# Altium project FMC_ADC.PrjPcb (part 2 of 4)

## Sheet ADC.SchDoc: ADC
size A3; Author: Wojciech Ruc³o; Organization: Warsaw Univeristy of Technology; Address1: Nowowiejska 15/19; DocumentNumber: 2; Revision: 1.0; SheetNumber: 2; SheetTotal: 12
Used 2 times, as channels U_ADC2, U_ADC1. Parts and nets are listed once, with the designators drawn on the sheet.
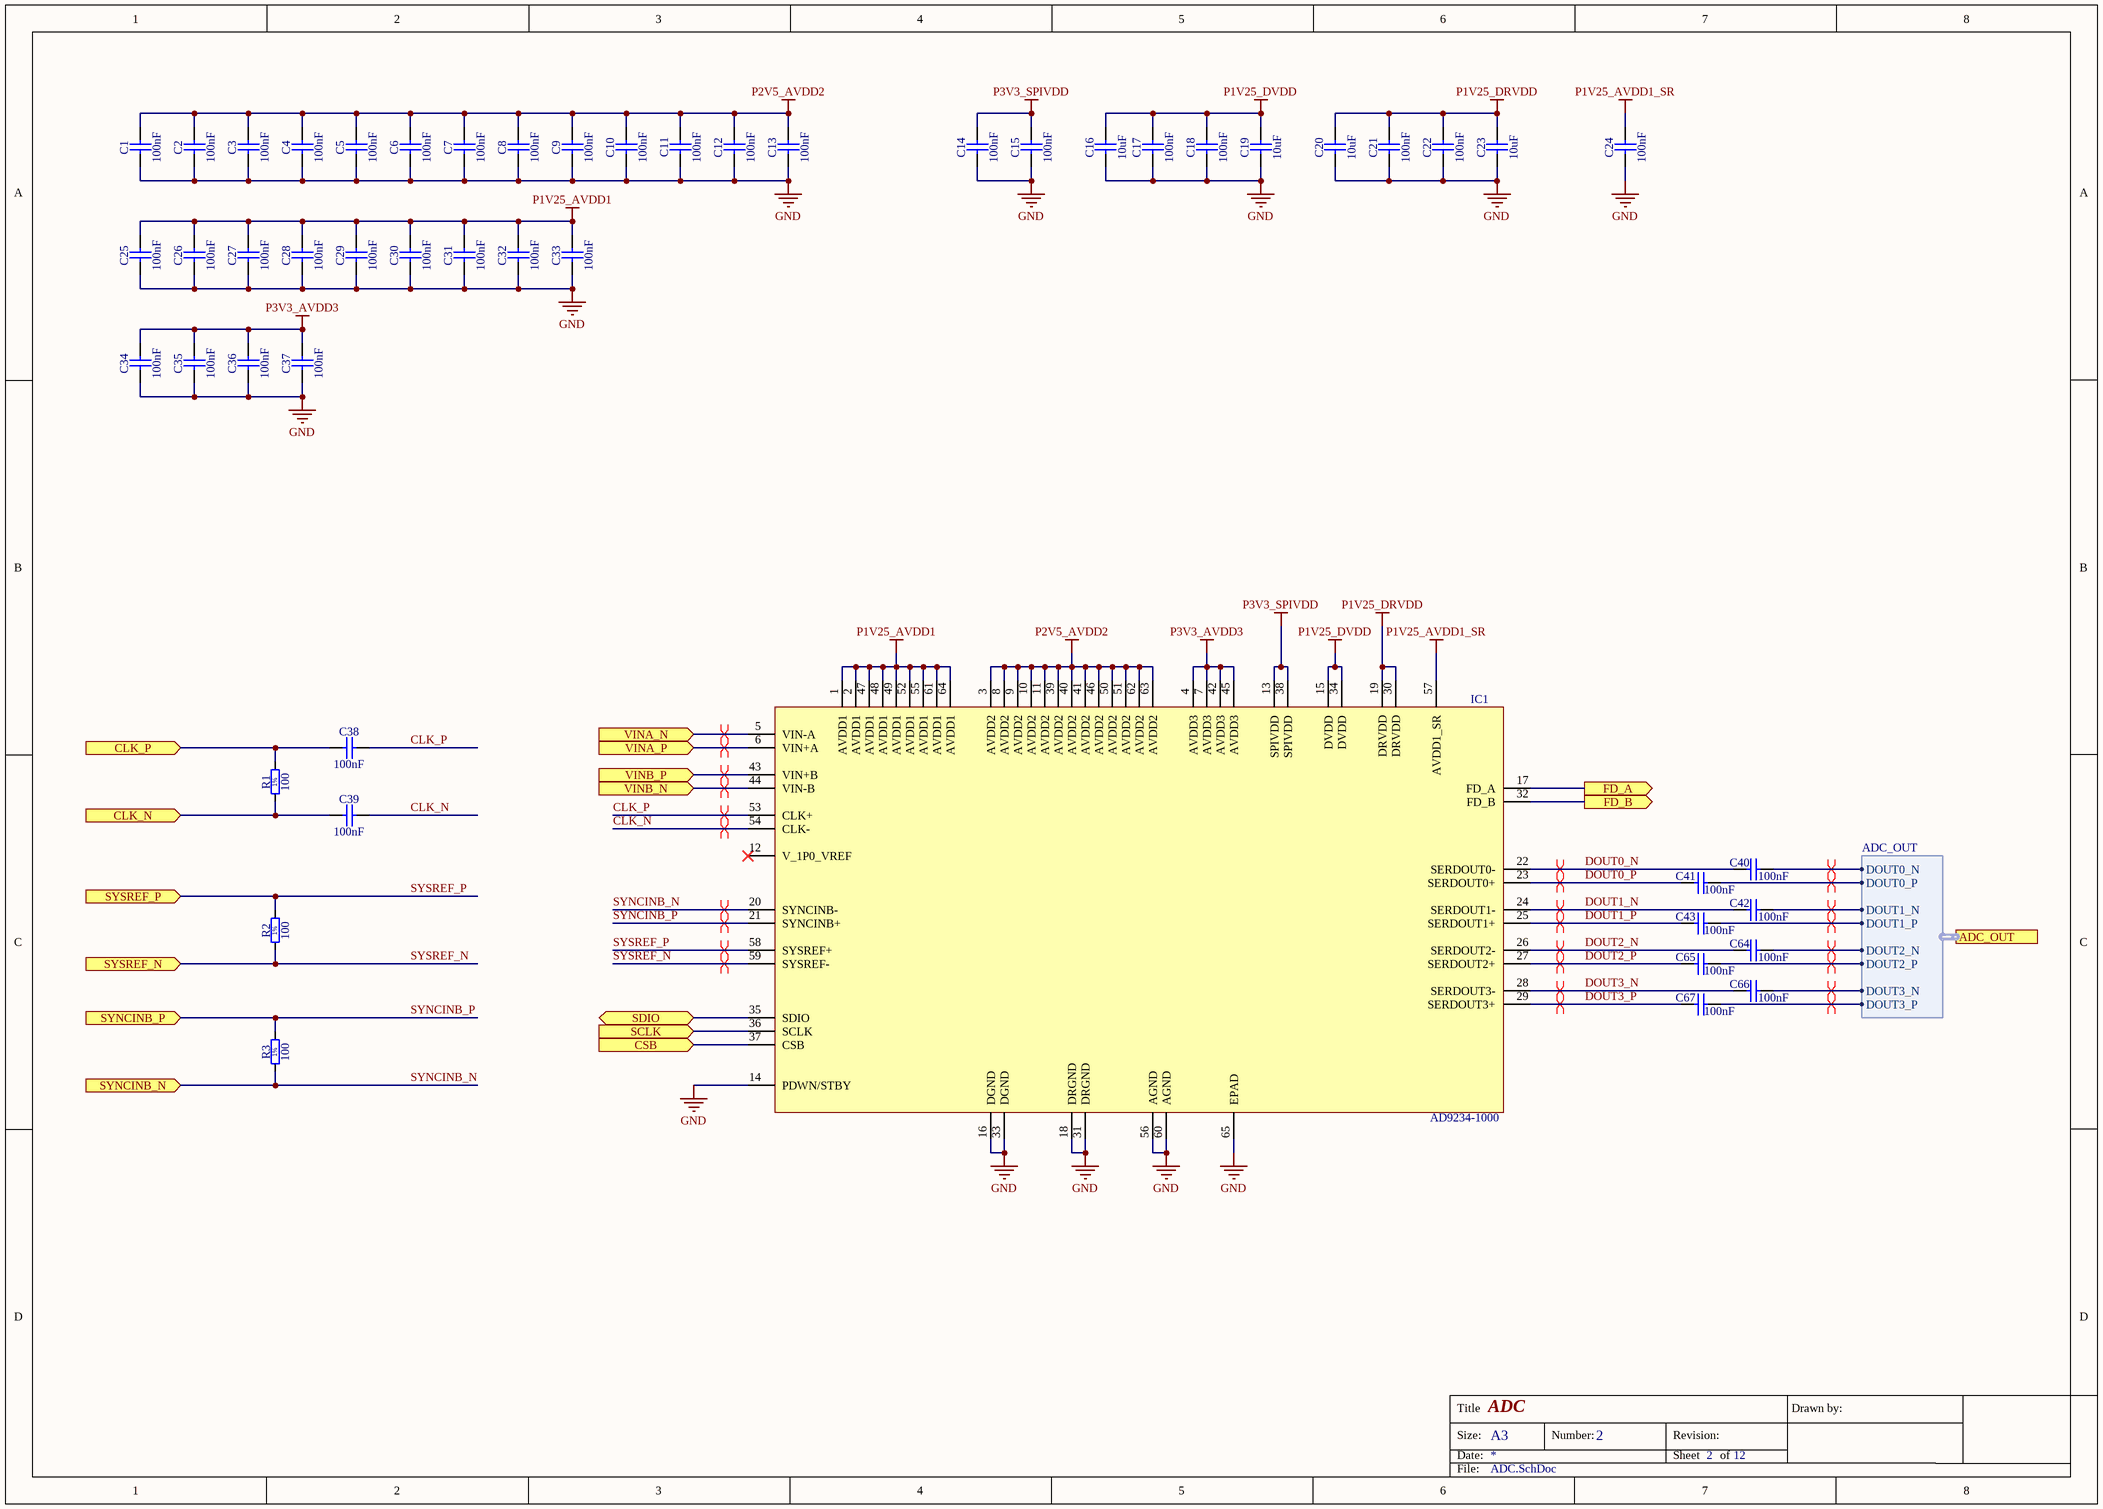
[diagram p3: ADC.SchDoc]

### Parts
C1  100nF  [CAPC0603X33N]
C2  100nF  [CAPC0603X33N]
C3  100nF  [CAPC0603X33N]
C4  100nF  [CAPC0603X33N]
C5  100nF  [CAPC0603X33N]
C6  100nF  [CAPC0603X33N]
C7  100nF  [CAPC0603X33N]
C8  100nF  [CAPC0603X33N]
C9  100nF  [CAPC0603X33N]
C10  100nF  [CAPC0603X33N]
C11  100nF  [CAPC0603X33N]
C12  100nF  [CAPC0603X33N]
C13  100nF  [CAPC0603X33N]
C14  100nF  [CAPC0603X33N]
C15  100nF  [CAPC0603X33N]
C16  10uF  [CAPC1608X87N]
C17  100nF  [CAPC0603X33N]
C18  100nF  [CAPC0603X33N]
C19  10uF  [CAPC1608X87N]
C20  10uF  [CAPC1608X87N]
C21  100nF  [CAPC0603X33N]
C22  100nF  [CAPC0603X33N]
C23  10uF  [CAPC1608X87N]
C24  100nF  [CAPC0603X33N]
C25  100nF  [CAPC0603X33N]
C26  100nF  [CAPC0603X33N]
C27  100nF  [CAPC0603X33N]
C28  100nF  [CAPC0603X33N]
C29  100nF  [CAPC0603X33N]
C30  100nF  [CAPC0603X33N]
C31  100nF  [CAPC0603X33N]
C32  100nF  [CAPC0603X33N]
C33  100nF  [CAPC0603X33N]
C34  100nF  [CAPC0603X33N]
C35  100nF  [CAPC0603X33N]
C36  100nF  [CAPC0603X33N]
C37  100nF  [CAPC0603X33N]
C38  100nF  [CAPC0603X33N]
C39  100nF  [CAPC0603X33N]
C40  100nF  [CAPC0603X33N]
C41  100nF  [CAPC0603X33N]
C42  100nF  [CAPC0603X33N]
C43  100nF  [CAPC0603X33N]
C64  100nF  [CAPC0603X33N]
C65  100nF  [CAPC0603X33N]
C66  100nF  [CAPC0603X33N]
C67  100nF  [CAPC0603X33N]
IC1  AD9234-1000  [CP_64_15]
R1  100  [RESC1005X40N]
R2  100  [RESC1005X40N]
R3  100  [RESC1005X40N]

### Ports
ADC_OUT (harness ADC_OUT), CLK_N (in), CLK_P (in), CSB (in), FD_A (out), FD_B (out), SCLK (in), SDIO (bidir), SYNCINB_N (in), SYNCINB_P (in), SYSREF_N (in), SYSREF_P (in), VINA_N (in), VINA_P (in), VINB_N (in), VINB_P (in)

### Harnesses
ADC_OUT: DOUT0_N, DOUT0_P, DOUT1_N, DOUT1_P, DOUT2_N, DOUT2_P, DOUT3_N, DOUT3_P

### Nets
GND: C1.1 C2.1 C3.1 C4.1 C5.1 C6.1 C7.1 C8.1 C9.1 C10.1 C11.1 C12.1 C13.1 C14.1 C15.1 C16.1 C17.1 C18.1 C19.1 C20.1 C21.1 C22.1 C23.1 C24.1 C25.1 C26.1 C27.1 C28.1 C29.1 C30.1 C31.1 C32.1 C33.1 C34.1 C35.1 C36.1 C37.1 IC1.14(PDWN/STBY) IC1.16(DGND) IC1.18(DRGND) IC1.31(DRGND) IC1.33(DGND) IC1.56(AGND) IC1.60(AGND) IC1.65(EPAD)
P1V25_AVDD1: C25.2 C26.2 C27.2 C28.2 C29.2 C30.2 C31.2 C32.2 C33.2 IC1.1(AVDD1) IC1.2(AVDD1) IC1.47(AVDD1) IC1.48(AVDD1) IC1.49(AVDD1) IC1.52(AVDD1) IC1.55(AVDD1) IC1.61(AVDD1) IC1.64(AVDD1)
P1V25_AVDD1_SR: C24.2 IC1.57(AVDD1_SR)
P1V25_DRVDD: C20.2 C21.2 C22.2 C23.2 IC1.19(DRVDD) IC1.30(DRVDD)
P1V25_DVDD: C16.2 C17.2 C18.2 C19.2 IC1.15(DVDD) IC1.34(DVDD)
P2V5_AVDD2: C1.2 C2.2 C3.2 C4.2 C5.2 C6.2 C7.2 C8.2 C9.2 C10.2 C11.2 C12.2 C13.2 IC1.3(AVDD2) IC1.8(AVDD2) IC1.9(AVDD2) IC1.10(AVDD2) IC1.11(AVDD2) IC1.39(AVDD2) IC1.40(AVDD2) IC1.41(AVDD2) IC1.46(AVDD2) IC1.50(AVDD2) IC1.51(AVDD2) IC1.62(AVDD2) IC1.63(AVDD2)
P3V3_AVDD3: C34.2 C35.2 C36.2 C37.2 IC1.4(AVDD3) IC1.7(AVDD3) IC1.42(AVDD3) IC1.45(AVDD3)
P3V3_SPIVDD: C14.2 C15.2 IC1.13(SPIVDD) IC1.38(SPIVDD)
CLK_N: C39.2 IC1.54(CLK-)
CLK_N: C39.1 R1.1 ; port CLK_N  [a separate net that carries the same name]
CLK_P: C38.2 IC1.53(CLK+)
CLK_P: C38.1 R1.2 ; port CLK_P  [a separate net that carries the same name]
CSB: IC1.37(CSB) ; port CSB
DOUT0_N: C40.1 IC1.22(SERDOUT0-)
DOUT0_P: C41.1 IC1.23(SERDOUT0+)
DOUT1_N: C42.1 IC1.24(SERDOUT1-)
DOUT1_P: C43.1 IC1.25(SERDOUT1+)
DOUT2_N: C64.1 IC1.26(SERDOUT2-)
DOUT2_P: C65.1 IC1.27(SERDOUT2+)
DOUT3_N: C66.1 IC1.28(SERDOUT3-)
DOUT3_P: C67.1 IC1.29(SERDOUT3+)
FD_A: IC1.17(FD_A) ; port FD_A
FD_B: IC1.32(FD_B) ; port FD_B
SCLK: IC1.36(SCLK) ; port SCLK
SDIO: IC1.35(SDIO) ; port SDIO
SYNCINB_N: IC1.20(SYNCINB-) R3.1 ; port SYNCINB_N
SYNCINB_P: IC1.21(SYNCINB+) R3.2 ; port SYNCINB_P
SYSREF_N: IC1.59(SYSREF-) R2.1 ; port SYSREF_N
SYSREF_P: IC1.58(SYSREF+) R2.2 ; port SYSREF_P
VINA_N: IC1.5(VIN-A) ; port VINA_N
VINA_P: IC1.6(VIN+A) ; port VINA_P
VINB_N: IC1.44(VIN-B) ; port VINB_N
VINB_P: IC1.43(VIN+B) ; port VINB_P
NetC40_2: C40.2 ; port ADC_OUT.DOUT0_N
NetC41_2: C41.2 ; port ADC_OUT.DOUT0_P
NetC42_2: C42.2 ; port ADC_OUT.DOUT1_N
NetC43_2: C43.2 ; port ADC_OUT.DOUT1_P
NetC64_2: C64.2 ; port ADC_OUT.DOUT2_N
NetC65_2: C65.2 ; port ADC_OUT.DOUT2_P
NetC66_2: C66.2 ; port ADC_OUT.DOUT3_N
NetC67_2: C67.2 ; port ADC_OUT.DOUT3_P

Not connected (* = marked no-connect by the designer): IC1 12(V_1P0_VREF)*

### Channels
U_ADC2: designators end in A; ports CLK_N=CLK_ADC2_N CLK_P=CLK_ADC2_P CSB=CS_ADC2 FD_A=FD_C FD_B=FD_D SCLK=SCLK_ADC SDIO=SDIO_ADC SYNCINB_N=LA03_N SYNCINB_P=LA03_P SYSREF_N=SYSREF2_N SYSREF_P=SYSREF2_P VINA_N=VINC_N VINA_P=VINC_P VINB_N=VIND_N VINB_P=VIND_P
U_ADC1: designators end in B; ports CLK_N=CLK_ADC1_N CLK_P=CLK_ADC1_P CSB=CS_ADC1 FD_A=FD_A FD_B=FD_B SCLK=SCLK_ADC SDIO=SDIO_ADC SYNCINB_N=LA30_N SYNCINB_P=LA30_P SYSREF_N=SYSREF1_N SYSREF_P=SYSREF1_P VINA_N=VINA_N VINA_P=VINA_P VINB_N=VINB_N VINB_P=VINB_P

### Layout directives
differential pair: CLK_N_U_ADC2, CLK_P_U_ADC2, DOUT0_N_U_ADC2, DOUT0_P_U_ADC2, DOUT1_N_U_ADC2, DOUT1_P_U_ADC2, DOUT2_N_U_ADC2, DOUT2_P_U_ADC2, DOUT3_N_U_ADC2, DOUT3_P_U_ADC2, DP0_M2C_N, DP0_M2C_P, DP1_M2C_N, DP1_M2C_P, DP2_M2C_N, DP2_M2C_P, DP3_M2C_N, DP3_M2C_P, LA03_N, LA03_P, SYSREF2_N, SYSREF2_P, VINC_N, VINC_P, VIND_N, VIND_P

### Notes on the sheet
- Title
- Size:
- Date:
- A3
- Number:
- Revision:
- Sheet
- of
- Drawn by:
- File:
- (in symbol R0402_100R_1%_0.0625W_100PPM) 1%

### Library data of the parts
C1-C15 C17 C18 C21 C22 C24-C43 C64-C67 = CC0201_100NF_6.3V_10%_X5R: as C78 on sheet FMC_CONNECTOR; Value: 100nF; Part Number: CC0201_100NF_6.3V_10%_X5R; Component Kind: Standard; Component Type: Standard; Pin Count: 2; Status: Not Recommended; Manufacturer Part Number: CC0201_100NF_6.3V_10%_X5R; Case: 0201; Mounted: Yes; Socket: No; SMD: Yes; Sense: No; Manufacturer1 Example: AVX; Manufacturer1 ComponentHeight: 0.33mm; HelpURL: \\cern.ch\dfs\Applications\Altium\Datasheets\CC0201_X5R_AVX.pdf; Author: CERN DEM JLC; CreateDate: 03.12.2007; LatestRevisionDate: 03.12.2007
C16 C19 C20 C23 = CC0603_10UF_6.3V_20%_X5R: Non-polarised capacitor; Part Description: SMD Multilayer Chip Ceramic Capacitor; Manufacturer: GENERIC; Manufacturer1 Part Number: C0603C106M9PAC; Voltage: 6.3V; TC: X5R; Tolerance: ±20%; Part Number: CC0603_10UF_6.3V_20%_X5R; Component Kind: Standard; Component Type: Standard; Pin Count: 2; Value: 10uF; Status: Preferred; Manufacturer Part Number: CC0603_10uF_6.3V_20%_X5R; Case: 0603; Mounted: Yes; Socket: No; SMD: Yes; Sense: No; Manufacturer1 Example: KEMET; Manufacturer1 ComponentHeight: 0.95mm; HelpURL: \\cern.ch\dfs\Applications\Altium\Datasheets\CC0603_X5R_KEMET.pdf; Author: CERN DEM JLC; CreateDate: 03.12.2007; LatestRevisionDate: 03.12.2007
IC1 = AD9234-1000: 12-Bit, 1 GSPS/500 MSPS JESD204B, Dual Analog-to-Digital Converter; Manufacturer: Analog Devices Inc; Manufacturer Part Number: AD9234BCPZ-1000
R1-R3 = R0402_100R_1%_0.0625W_100PPM: Resistor - 1%; Part Description: General Purpose Thick Film Chip Resistor; Manufacturer: GENERIC; Manufacturer1 Part Number: 232270671001L; TC: ±100ppm/°C; Part Number: R0402_100R_1%_0.0625W_100PPM; Component Kind: Standard; Component Type: Standard; Pin Count: 2; Value: 100; Status: Not recommended; Power: 0.0625W; Tolerance: ±1%; Manufacturer Part Number: R0402_100R_1%_0.0625W_100PPM; Case: 0402; Mounted: Yes; Socket: No; SMD: Yes; Manufacturer1 Example: YAGEO PHYCOMP; Manufacturer1 ComponentHeight: 0.4mm; HelpURL: \\cern.ch\dfs\Applications\Altium\Datasheets\R0402_Phycomp_RC0402.pdf; Author: CERN DEM JLC; CreateDate: 03.12.2007; LatestRevisionDate: 17.10.2012; Sense: No

## Sheet CLOCK.SchDoc: Clocks
size A3; Author: Wojciech Ruc³o; Organization: Warsaw Univeristy of Technology; Address1: Nowowiejska 15/19; DocumentNumber: 5; Revision: 1.0; SheetNumber: 5; SheetTotal: 12
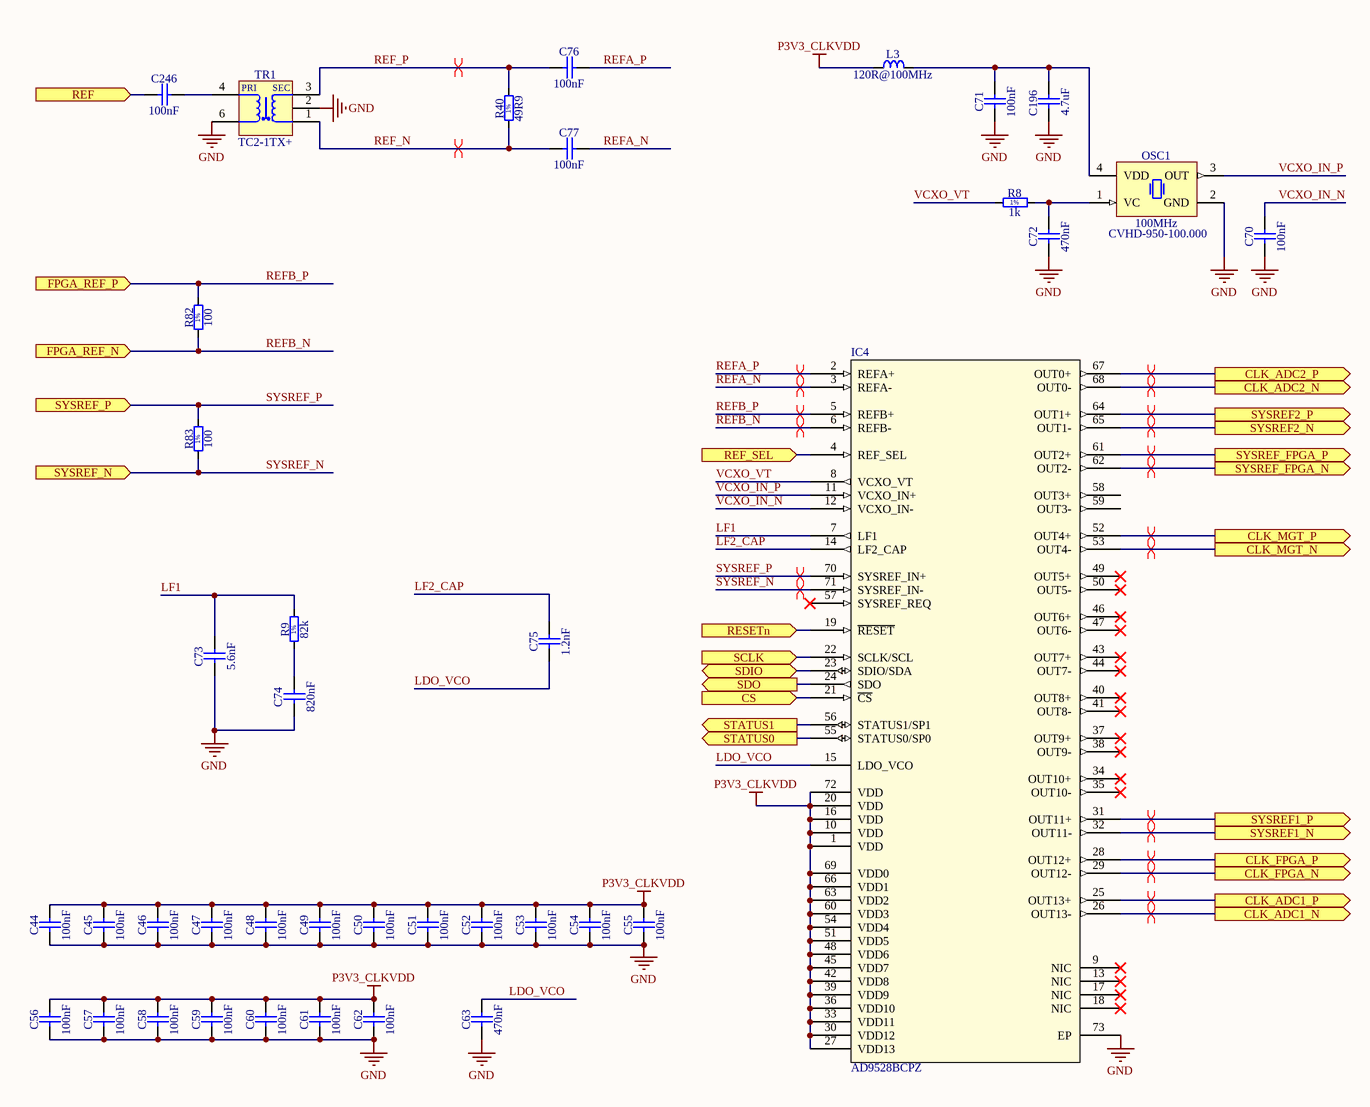
[diagram p4: CLOCK.SchDoc]

### Parts
C44  100nF  [CAPC0603X33N]
C45  100nF  [CAPC0603X33N]
C46  100nF  [CAPC0603X33N]
C47  100nF  [CAPC0603X33N]
C48  100nF  [CAPC0603X33N]
C49  100nF  [CAPC0603X33N]
C50  100nF  [CAPC0603X33N]
C51  100nF  [CAPC0603X33N]
C52  100nF  [CAPC0603X33N]
C53  100nF  [CAPC0603X33N]
C54  100nF  [CAPC0603X33N]
C55  100nF  [CAPC0603X33N]
C56  100nF  [CAPC0603X33N]
C57  100nF  [CAPC0603X33N]
C58  100nF  [CAPC0603X33N]
C59  100nF  [CAPC0603X33N]
C60  100nF  [CAPC0603X33N]
C61  100nF  [CAPC0603X33N]
C62  100nF  [CAPC0603X33N]
C63  470nF  [CAPC1005X55N]
C70  100nF  [CAPC0603X33N]
C71  100nF  [CAPC0603X33N]
C72  470nF  [CAPC1005X55N]
C73  5.6nF  [CAPC2012X88N]
C74  820nF  [CAPC3216X130N]
C75  1.2nF  [CAPC1608X80N]
C76  100nF  [CAPC1005X55N]
C77  100nF  [CAPC1005X55N]
C196  4.7uF  [CAPC1608X87N]
C246  100nF  [CAPC0603X33N]
IC4  AD9528BCPZ  [CP_72_6]
L3  120R@100MHz  [INDC1608X65N]
OSC1  100MHz  Manufacturer Part Number: CVHD-950-100.000  [OSC_CRYSTEK_CVHD-950]
R8  1k  [RESC1005X40N]
R9  82k  [RESC1005X40N]
R40  49R9  [RESC1005X40N]
R82  100  [RESC1005X40N]
R83  100  [RESC1005X40N]
TR1  TC2-1TX+  [XFMR_MINI-CIRCUITS_AT1521]

### Ports
CLK_ADC1_N (out), CLK_ADC1_P (out), CLK_ADC2_N (out), CLK_ADC2_P (out), CLK_FPGA_N (out), CLK_FPGA_P (out), CLK_MGT_N (out), CLK_MGT_P (out), CS (in), FPGA_REF_N (in), FPGA_REF_P (in), REF (in), REF_SEL (in), RESETn (in), SCLK (in), SDIO (bidir), SDO (out), STATUS0 (out), STATUS1 (out), SYSREF1_N (out), SYSREF1_P (out), SYSREF2_N (out), SYSREF2_P (out), SYSREF_FPGA_N (out), SYSREF_FPGA_P (out), SYSREF_N (in), SYSREF_P (in)

### Nets
GND: C44.1 C45.1 C46.1 C47.1 C48.1 C49.1 C50.1 C51.1 C52.1 C53.1 C54.1 C55.1 C56.1 C57.1 C58.1 C59.1 C60.1 C61.1 C62.1 C63.1 C70.1 C71.1 C72.1 C73.1 C74.1 C196.1 IC4.73(EP) OSC1.2(GND) TR1.2(NU) TR1.6(PDOT)
P3V3_CLKVDD: C44.2 C45.2 C46.2 C47.2 C48.2 C49.2 C50.2 C51.2 C52.2 C53.2 C54.2 C55.2 C56.2 C57.2 C58.2 C59.2 C60.2 C61.2 C62.2 IC4.1(VDD) IC4.10(VDD) IC4.16(VDD) IC4.20(VDD) IC4.27(VDD13) IC4.30(VDD12) IC4.33(VDD11) IC4.36(VDD10) IC4.39(VDD9) IC4.42(VDD8) IC4.45(VDD7) IC4.48(VDD6) IC4.51(VDD5) IC4.54(VDD4) IC4.60(VDD3) IC4.63(VDD2) IC4.66(VDD1) IC4.69(VDD0) IC4.72(VDD) L3.1
CLK_ADC1_N: IC4.26(OUT13-) ; port CLK_ADC1_N
CLK_ADC1_P: IC4.25(OUT13+) ; port CLK_ADC1_P
CLK_ADC2_N: IC4.68(OUT0-) ; port CLK_ADC2_N
CLK_ADC2_P: IC4.67(OUT0+) ; port CLK_ADC2_P
CLK_FPGA_N: IC4.29(OUT12-) ; port CLK_FPGA_N
CLK_FPGA_P: IC4.28(OUT12+) ; port CLK_FPGA_P
CLK_MGT_N: IC4.53(OUT4-) ; port CLK_MGT_N
CLK_MGT_P: IC4.52(OUT4+) ; port CLK_MGT_P
CS_CLK: IC4.21(~{CS}) ; port CS
LA01_CC_N: IC4.62(OUT2-) ; port SYSREF_FPGA_N
LA01_CC_P: IC4.61(OUT2+) ; port SYSREF_FPGA_P
LDO_VCO: C63.2 C75.1 IC4.15(LDO_VCO)
LF1: C73.2 IC4.7(LF1) R9.2
LF2_CAP: C75.2 IC4.14(LF2_CAP)
REF_N: C77.1 R40.1 TR1.1(SDOT)
REF_P: C76.1 R40.2 TR1.3(S)
REF_SEL: IC4.4(REF_SEL) ; port REF_SEL
REFA_N: C77.2 IC4.3(REFA-)
REFA_P: C76.2 IC4.2(REFA+)
REFB_N: IC4.6(REFB-) R82.1 ; port FPGA_REF_N  [project net FPGA_REF_N]
REFB_P: IC4.5(REFB+) R82.2 ; port FPGA_REF_P  [project net FPGA_REF_P]
RESETn: IC4.19(~{RESET}) ; port RESETn
SCLK_CLK: IC4.22(SCLK/SCL) ; port SCLK
SDIO_CLK: IC4.23(SDIO/SDA) ; port SDIO
SDO_CLK: IC4.24(SDO) ; port SDO
STATUS0: IC4.55(STATUS0/SP0) ; port STATUS0
STATUS1: IC4.56(STATUS1/SP1) ; port STATUS1
SYSREF1_N: IC4.32(OUT11-) ; port SYSREF1_N
SYSREF1_P: IC4.31(OUT11+) ; port SYSREF1_P
SYSREF2_N: IC4.65(OUT1-) ; port SYSREF2_N
SYSREF2_P: IC4.64(OUT1+) ; port SYSREF2_P
SYSREF_N: IC4.71(SYSREF_IN-) R83.1 ; port SYSREF_N  [project net LA00_CC_N]
SYSREF_P: IC4.70(SYSREF_IN+) R83.2 ; port SYSREF_P  [project net LA00_CC_P]
VCXO_IN_N: C70.2 IC4.12(VCXO_IN-)
VCXO_IN_P: IC4.11(VCXO_IN+) OSC1.3(OUT)
VCXO_VT: IC4.8(VCXO_VT) R8.1
NetC71_2: C71.2 C196.2 L3.2 OSC1.4(VDD)
NetC72_2: C72.2 OSC1.1(VC) R8.2
NetC74_2: C74.2 R9.1
NetC246_1: C246.1 ; port REF
NetC246_2: C246.2 TR1.4(P)

Not connected (* = marked no-connect by the designer): IC4 9(NIC)* 13(NIC)* 17(NIC)* 18(NIC)* 34(OUT10+)* 35(OUT10-)* 37(OUT9+)* 38(OUT9-)* 40(OUT8+)* 41(OUT8-)* 43(OUT7+)* 44(OUT7-)* 46(OUT6+)* 47(OUT6-)* 49(OUT5+)* 50(OUT5-)* 57(SYSREF_REQ)* 58(OUT3+) 59(OUT3-)

### Layout directives
differential pair: CLK_ADC1_N, CLK_ADC1_P, CLK_ADC2_N, CLK_ADC2_P, CLK_FPGA_N, CLK_FPGA_P, CLK_MGT_N, CLK_MGT_P, FPGA_REF_N, FPGA_REF_P, LA00_CC_N, LA00_CC_P, LA01_CC_N, LA01_CC_P, REF_N, REF_P, REFA_N, REFA_P, SYSREF1_N, SYSREF1_P, SYSREF2_N, SYSREF2_P

### Notes on the sheet
- Title
- Size:
- Date:
- A3
- Number:
- Revision:
- Sheet
- of
- Drawn by:
- File:
- (in symbol R0402_1K_1%_0.0625W_100PPM) 1%
- (in symbol R0402_49R9_1%_0.0625W_100PPM) 1%
- (in symbol R0402_82K_1%_0.0625W_100PPM) 1%
- (in symbol R0402_100R_1%_0.0625W_100PPM) 1%
- (in symbol XFMR_MINI-CIRCUITS_TC2-1TX+) PRI; SEC

### Library data of the parts
C44-C62 C70 C71 = CC0201_100NF_6.3V_10%_X5R: Non-polarised capacitor; Part Description: SMD Multilayer Chip Ceramic Capacitor; Manufacturer: GENERIC; Manufacturer1 Part Number: 02016D104KAT2A; Tolerance: ±10%; Voltage: 6.3V; TC: X5R; Value: 100nF; Part Number: CC0201_100NF_6.3V_10%_X5R; Component Kind: Standard; Component Type: Standard; Pin Count: 2; Status: Not Recommended; Manufacturer Part Number: CC0201_100NF_6.3V_10%_X5R; Case: 0201; Mounted: Yes; Socket: No; SMD: Yes; Sense: No; Manufacturer1 Example: AVX; Manufacturer1 ComponentHeight: 0.33mm; HelpURL: \\cern.ch\dfs\Applications\Altium\Datasheets\CC0201_X5R_AVX.pdf; Author: CERN DEM JLC; CreateDate: 03.12.2007; LatestRevisionDate: 03.12.2007
C63 C72 = CC0402_470NF_6.3V_10%_X5R: Non-polarised capacitor; Part Description: SMD Multilayer Chip Ceramic Capacitor; Manufacturer: GENERIC; Manufacturer1 Part Number: GRM155R60J474KE19D; Tolerance: ±10%; Voltage: 6.3V; TC: X5R; Value: 470nF; Part Number: CC0402_470NF_6.3V_10%_X5R; Component Kind: Standard; Component Type: Standard; Pin Count: 2; Status: Preferred; Manufacturer Part Number: CC0402_470NF_6.3V_10%_X5R; Case: 0402; Mounted: Yes; Socket: No; SMD: Yes; Sense: No; Manufacturer1 Example: MURATA; Manufacturer1 ComponentHeight: 0.55mm; HelpURL: \\cern.ch\dfs\Applications\Altium\Datasheets\CC0402_X5R_MURATA_GRM.pdf; Author: CERN DEM JLC; CreateDate: 22.04.2010; LatestRevisionDate: 22.04.2010
C73 = CC0805_5.6NF_50V_5%_C0G: Non-polarised capacitor; Part Description: SMD Multilayer Chip Ceramic Capacitor; Manufacturer: GENERIC; Manufacturer1 Part Number: GRM2195C1H562JA01D; Voltage: 50V; TC: C0G/NP0; Tolerance: ±5%; Part Number: CC0805_5.6NF_50V_5%_C0G; Component Kind: Standard; Component Type: Standard; Pin Count: 2; Value: 5.6nF; Status: Preferred; Manufacturer Part Number: CC0805_5.6NF_50V_5%_C0G; Case: 0805; Mounted: Yes; Socket: No; SMD: Yes; Sense: No; Manufacturer1 Example: Murata; Manufacturer1 ComponentHeight: 0.85mm; Author: *
C74 = CC1206_820NF_25V_10%_X7R: Non-polarised capacitor; Part Description: SMD Multilayer Chip Ceramic Capacitor; Manufacturer: GENERIC; Manufacturer1 Part Number: 12063C824KAT2A; Voltage: 25V; TC: X7R; Tolerance: ±10%; Part Number: CC1206_820NF_25V_10%_X7R; Component Kind: Standard; Component Type: Standard; Pin Count: 2; Value: 820nF; Manufacturer Part Number: CC1206_820NF_25V_10%_X7R; Case: 1206; Mounted: Yes; Socket: No; SMD: Yes; Sense: No; Manufacturer1 ComponentHeight: 1.25mm; Manufacturer1 Example: AVX
C75 = CC0603_1.2NF_50V_5%_C0G: Non-polarised capacitor; Part Description: SMD Multilayer Chip Ceramic Capacitor; Manufacturer: GENERIC; Manufacturer1 Part Number: C0603C122J5GACTU; Tolerance: ±5%; Voltage: 50V; TC: C0G/NP0; Value: 1.2nF; Part Number: CC0603_1.2NF_50V_5%_C0G; Component Kind: Standard; Component Type: Standard; Pin Count: 2; Status: Preferred; Manufacturer Part Number: CC0603_1.2NF_50V_5%_C0G; Case: 0603; Mounted: Yes; Socket: No; SMD: Yes; Sense: No; Manufacturer1 Example: KEMET; Manufacturer1 ComponentHeight: 0.8mm; Author: *
C76 C77 = CC0402_100NF_16V_10%_X5R: Non-polarised capacitor; Part Description: SMD Multilayer Chip Ceramic Capacitor; Manufacturer: GENERIC; Manufacturer1 Part Number: GRM155R61C104KA88D; Tolerance: ±10%; Voltage: 16V; TC: X5R; Value: 100nF; Part Number: CC0402_100NF_16V_10%_X5R; Component Kind: Standard; Component Type: Standard; Pin Count: 2; Status: None; Manufacturer Part Number: CC0402_100NF_16V_10%_X5R; Case: 0402; Mounted: Yes; Socket: No; SMD: Yes; Sense: No; Manufacturer1 Example: MURATA; Manufacturer1 ComponentHeight: 0.55mm; HelpURL: \\cern.ch\dfs\Applications\Altium\Datasheets\CC0402_X5R_MURATA_GRM.pdf; Author: CERN DEM JLC; CreateDate: 10.12.2013; LatestRevisionDate: 10.12.2013
C196 = CC0603_4.7UF_6.3V_10%_X5R: Non-polarised capacitor; Part Description: SMD Multilayer Chip Ceramic Capacitor; Manufacturer: GENERIC; Manufacturer1 Part Number: 225520613672; Voltage: 6.3V; TC: X5R; Tolerance: ±10%; Part Number: CC0603_4.7UF_6.3V_10%_X5R; Component Kind: Standard; Component Type: Standard; Pin Count: 2; Value: 4.7uF; Status: Preferred; Manufacturer Part Number: CC0603_4.7uF_6.3V_10%_X5R; Case: 0603; Mounted: Yes; Socket: No; SMD: Yes; Manufacturer1 Example: PHYCOMP; Manufacturer1 ComponentHeight: 0.87mm; HelpURL: \\cern.ch\dfs\Applications\Altium\Datasheets\CC0805_X5R_PHYCOMP_HC.pdf; Author: CERN DEM JLC; CreateDate: 03.12.2007; LatestRevisionDate: 03.12.2007; Sense: No
C246 = CC0201_100NF_6.3V_10%_X5R: Non-polarised capacitor; Part Description: SMD Multilayer Chip Ceramic Capacitor; Manufacturer: GENERIC; Manufacturer1 Part Number: 02016D104KAT2A; Voltage: 6.3V; TC: X5R; Tolerance: ±10%; Part Number: CC0201_100NF_6.3V_10%_X5R; Component Kind: Standard; Component Type: Standard; Pin Count: 2; Value: 100nF; Status: Not Recommended; Manufacturer Part Number: CC0201_100NF_6.3V_10%_X5R; Case: 0201; Mounted: Yes; Socket: No; SMD: Yes; Sense: No; Manufacturer1 Example: AVX; Manufacturer1 ComponentHeight: 0.33mm; HelpURL: \\cern.ch\dfs\Applications\Altium\Datasheets\CC0201_X5R_AVX.pdf; Author: CERN DEM JLC; CreateDate: 03.12.2007; LatestRevisionDate: 03.12.2007
IC4 = AD9528BCPZ: JESD204B Clock Generator with 14 LVDS/HSTL Outputs; Manufacturer: Analog Devices; Manufacturer Part Number: AD9528BCPZ
L3 = IND0603_MURATA_BLM18SG121TN1D: Inductor; Part Description: SMD EMIFIL Suppression Chip Ferrite Bead; Manufacturer: MURATA; Power: 3A; Resistance: 0.025R; Tolerance: ±25%; Part Number: IND0603_MURATA_BLM18SG121TN1D; Component Kind: Standard; Component Type: Standard; Pin Count: 2; Value: 120R@100MHz; Status: None; Manufacturer Part Number: BLM18SG121TN1D; Case: 0603; Mounted: Yes; Socket: No; SMD: Yes; Sense: No; ComponentHeight: 0.65mm; HelpURL: \\cern.ch\dfs\Applications\Altium\Datasheets\IND0603_MURATA_BLM18S.pdf; Author: CERN DEM JLC; CreateDate: 23.07.2014; LatestRevisionDate: 23.07.2014
OSC1 = OSC_125MHZ_CRYSTEK_CVHD-950-100.000: Oscillator 4 pins 1=VC 2=GND 3=OUT 4=VDD; Part Description: 3.3V, ±20ppm, 15pF, 0..70°C, CMOS Surface Mount Ultra-Low Noise Oscillator (CVHD-950 Series); Manufacturer: CRYSTEK CRYSTAL; PressFit: No; Bonding: No; Part Number: OSC_125MHZ_CRYSTEK_CVHD-950-100.000; Component Kind: Standard; Component Type: Standard; PackageDescription: Oscillator, 5.08mm Pitch; 4 Pin, 14.2mm L X 9.14mm W X 5.3mm H, CVHD-950 Serie; Value: 100MHz; Pin Count: 4; Mounted: Yes; Socket: No; SMD: Yes; ComponentHeight: 5.3mm; HelpURL: \\cern.ch\dfs\Applications\Altium\Datasheets\OSC_CRYSTEK_CVHD-950.pdf; Author: CERN DEM JLC; CreateDate: 09.10.2012; LatestRevisionDate: 09.10.2012; Sense: No
R8 = R0402_1K_1%_0.0625W_100PPM: Resistor - 1%; Part Description: General Purpose Thick Film Chip Resistor; Manufacturer: GENERIC; Manufacturer1 Part Number: 232270671002L; TC: ±100ppm/°C; Tolerance: ±1%; Value: 1k; Power: 0.0625W; Part Number: R0402_1K_1%_0.0625W_100PPM; Component Kind: Standard; Component Type: Standard; Pin Count: 2; Status: Not recommended; Manufacturer Part Number: R0402_1K_1%_0.0625W_100PPM; Case: 0402; Mounted: Yes; Sense: No; Socket: No; SMD: Yes; Manufacturer1 Example: YAGEO PHYCOMP; Manufacturer1 ComponentHeight: 0.4mm; HelpURL: \\cern.ch\dfs\Applications\Altium\Datasheets\R0402_Phycomp_RC0402.pdf; Author: CERN DEM JLC; CreateDate: 03.12.2007; LatestRevisionDate: 17.10.2012
R9 = R0402_82K_1%_0.0625W_100PPM: Resistor - 1%; Part Description: General Purpose Thick Film Chip Resistor; Manufacturer: GENERIC; Manufacturer1 Part Number: 232270678203L; TC: ±100ppm/°C; Value: 82k; Tolerance: ±1%; Power: 0.0625W; Part Number: R0402_82K_1%_0.0625W_100PPM; Component Kind: Standard; Component Type: Standard; Pin Count: 2; Status: Not recommended; Manufacturer Part Number: R0402_82K_1%_0.0625W_100PPM; Case: 0402; Mounted: Yes; Sense: No; Socket: No; SMD: Yes; Manufacturer1 Example: YAGEO PHYCOMP; Manufacturer1 ComponentHeight: 0.4mm; HelpURL: \\cern.ch\dfs\Applications\Altium\Datasheets\R0402_Phycomp_RC0402.pdf; Author: CERN DEM JLC; CreateDate: 03.12.2007; LatestRevisionDate: 17.10.2012
R40 = R0402_49R9_1%_0.0625W_100PPM: Resistor - 1%; Part Description: General Purpose Thick Film Chip Resistor; Manufacturer: GENERIC; Manufacturer1 Part Number: 232270674999L or RC0402FR-0749R9L; TC: ±100ppm/°C; Part Number: R0402_49R9_1%_0.0625W_100PPM; Component Kind: Standard; Component Type: Standard; Pin Count: 2; Value: 49R9; Status: Not recommended; Power: 0.0625W; Tolerance: ±1%; Manufacturer Part Number: R0402_49R9_1%_0.0625W_100PPM; Case: 0402; Mounted: Yes; Sense: No; Socket: No; SMD: Yes; Manufacturer1 Example: YAGEO PHYCOMP; Manufacturer1 ComponentHeight: 0.4mm; HelpURL: \\cern.ch\dfs\Applications\Altium\Datasheets\R0402_Phycomp_RC0402.pdf; Author: CERN DEM JLC; CreateDate: 24.10.2012; LatestRevisionDate: 24.10.2012
R82 R83 = R0402_100R_1%_0.0625W_100PPM: Resistor - 1%; Part Description: General Purpose Thick Film Chip Resistor; Manufacturer: GENERIC; Manufacturer1 Part Number: 232270671001L; TC: ±100ppm/°C; Part Number: R0402_100R_1%_0.0625W_100PPM; Component Kind: Standard; Component Type: Standard; Pin Count: 2; Value: 100; Status: Not recommended; Power: 0.0625W; Tolerance: ±1%; Manufacturer Part Number: R0402_100R_1%_0.0625W_100PPM; Case: 0402; Mounted: Yes; Socket: No; SMD: Yes; Manufacturer1 Example: YAGEO PHYCOMP; Manufacturer1 ComponentHeight: 0.4mm; HelpURL: \\cern.ch\dfs\Applications\Altium\Datasheets\R0402_Phycomp_RC0402.pdf; Author: CERN DEM JLC; CreateDate: 03.12.2007; LatestRevisionDate: 17.10.2012; Sense: No
TR1 = XFMR_MINI-CIRCUITS_TC2-1TX+: 50 Ohm 3 to 300MHz RF Transformer; Manufacturer: MINI-CIRCUITS; Manufacturer Part Number: TC2-1TX+; HelpURL: https://ww2.minicircuits.com/pdfs/TC2-1TX+.pdf

## Sheet POWER_SUPPLY_1.SchDoc: Power Supply
size A3; Author: Wojciech Ruc³o; Organization: Warsaw Univeristy of Technology; Address1: Nowowiejska 15/19; DocumentNumber: 8; Revision: 1.0; SheetNumber: 8; SheetTotal: 12
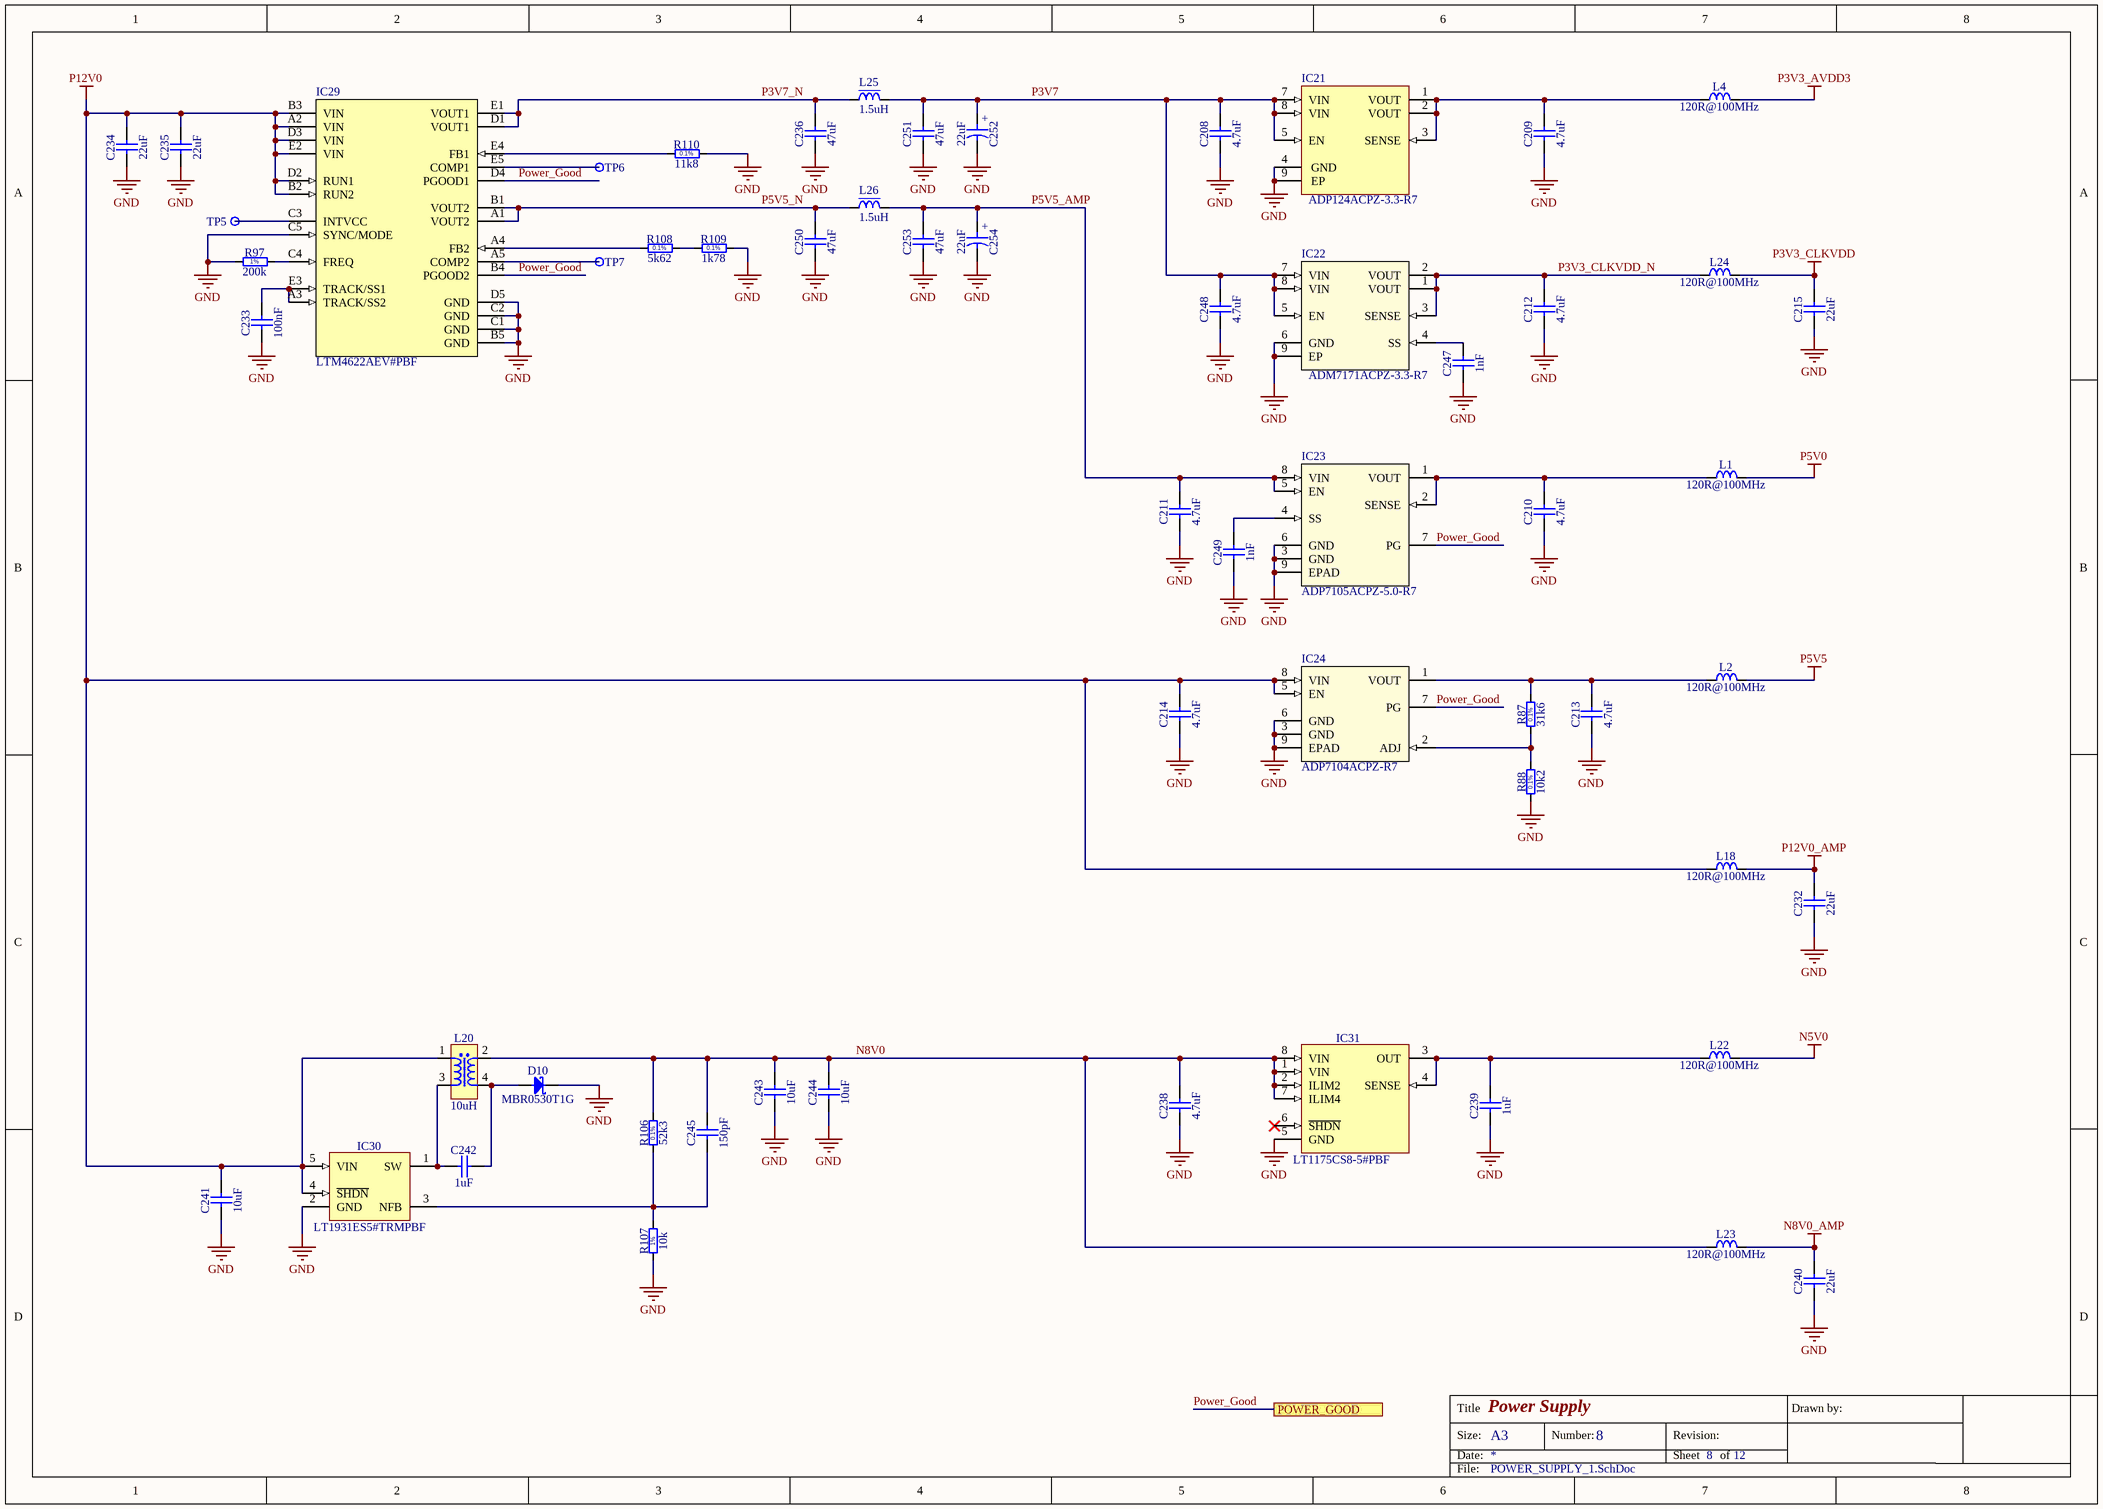
[diagram p5: POWER_SUPPLY_1.SchDoc]

### Parts
C208  4.7uF  [CAPC1709X95N]
C209  4.7uF  [CAPC1709X95N]
C210  4.7uF  [CAPC1709X95N]
C211  4.7uF  [CAPC1709X95N]
C212  4.7uF  [CAPC1709X95N]
C213  4.7uF  [CAPC1709X95N]
C214  4.7uF  [CAPC1709X95N]
C215  22uF  [CAPC1709X100N]
C232  22uF  [CAPC1709X100N]
C233  100nF  [CAPC1005X55N]
C234  22uF  [CAPC2012X135N]
C235  22uF  [CAPC2012X135N]
C236  47uF  [CAPC3225X270N]
C238  4.7uF  [CAPC1709X95N]
C239  1uF  [CAPC1608X87N]
C240  22uF  [CAPC1709X100N]
C241  10uF  [CAPC2012X135N]
C242  1uF  [CAPC1608X87N]
C243  10uF  [CAPC2012X135N]
C244  10uF  [CAPC2012X135N]
C245  150pF  [CAPC1005X55N]
C247  1nF  [CAPC0603X33N]
C248  4.7uF  [CAPC1709X95N]
C249  1nF  [CAPC0603X33N]
C250  47uF  [CAPC3225X270N]
C251  47uF  [CAPC3225X270N]
C252  22uF  [CAPMP3528X210N]
C253  47uF  [CAPC3225X270N]
C254  22uF  [CAPMP3528X210N]
D10  MBR0530T1G  [SOD3715X145N]
IC21  ADP124ACPZ-3.3-R7  [CP_8_8-L]
IC22  ADM7171ACPZ-3.3-R7  [CP_8_21-L]
IC23  ADP7105ACPZ-5.0-R7  [CP_8_5]
IC24  ADP7104ACPZ-R7  [CP_8_5]
IC29  LTM4622AEV#PBF  [LGA25C127P5X5_625X625X182]
IC30  LT1931ES5#TRMPBF  [SOT95P280X100-5N]
IC31  LT1175CS8-5#PBF  [SOIC127P600X175-8N]
L1  120R@100MHz  [INDC1608X65N]
L2  120R@100MHz  [INDC1608X65N]
L4  120R@100MHz  [INDC1608X65N]
L18  120R@100MHz  [INDC1608X65N]
L20  10uH  [IND_BOURNS_SRF0703]
L22  120R@100MHz  [INDC1608X65N]
L23  120R@100MHz  [INDC1608X65N]
L24  120R@100MHz  [INDC1608X65N]
L25  1.5uH  [IND_SPM4020]
L26  1.5uH  [IND_SPM4020]
R87  31k6  [RESC1608X55N]
R88  10k2  [RESC1608X55N]
R97  200k  [RESC1005X40N]
R106  52k3  [RESC1608X55N]
R107  10k  [RESC1608X55N]
R108  5k62  [RESC1608X55N]
R109  1k78  [RESC1608X55N]
R110  11k8  [RESC1608X55N]
TP5  Test Point  [TPS62]  (value not drawn)
TP6  Test Point  [TPS62]  (value not drawn)
TP7  Test Point  [TPS62]  (value not drawn)

### Ports
POWER_GOOD

### Nets
GND: C208.1 C209.1 C210.1 C211.1 C212.1 C213.1 C214.1 C215.1 C232.1 C233.1 C234.1 C235.1 C236.1 C238.1 C239.1 C240.1 C241.1 C243.1 C244.1 C247.1 C248.1 C249.1 C250.1 C251.1 C252.2 C253.1 C254.2 D10.1(C) IC21.4(GND) IC21.9(EP) IC22.6(GND) IC22.9(EP) IC23.3(GND) IC23.6(GND) IC23.9(EPAD) IC24.3(GND) IC24.6(GND) IC24.9(EPAD) IC29.B5(GND) IC29.C1(GND) IC29.C2(GND) IC29.C5(SYNC/MODE) IC29.D5(GND) IC30.2(GND) IC31.5(GND) R88.1 R97.1 R107.1 R109.2 R110.2
N5V0: L22.2
N8V0_AMP: C240.2 L23.2
P3V3_AVDD3: L4.2
P3V3_CLKVDD: C215.2 L24.2
P5V0: L1.2
P5V5: L2.2
P12V0: C214.2 C234.2 C235.2 C241.2 IC24.5(EN) IC24.8(VIN) IC29.A2(VIN) IC29.B2(RUN2) IC29.B3(VIN) IC29.D2(RUN1) IC29.D3(VIN) IC29.E2(VIN) IC30.4(~{SHDN}) IC30.5(VIN) L18.1 L20.1  [project net 12P0V]
P12V0_AMP: C232.2 L18.2
N8V0: C238.2 C243.2 C244.2 C245.2 IC31.1(VIN) IC31.2(ILIM2) IC31.7(ILIM4) IC31.8(VIN) L20.2 L23.1 R106.2
P3V3_CLKVDD_N: C212.2 IC22.1(VOUT) IC22.2(VOUT) IC22.3(SENSE) L24.1
P3V7: C208.2 C248.2 C251.2 C252.1 IC21.5(EN) IC21.7(VIN) IC21.8(VIN) IC22.5(EN) IC22.7(VIN) IC22.8(VIN) L25.2
P3V7_N: C236.2 IC29.D1(VOUT1) IC29.E1(VOUT1) L25.1
P5V5_AMP: C211.2 C253.2 C254.1 IC23.5(EN) IC23.8(VIN) L26.2
P5V5_N: C250.2 IC29.A1(VOUT2) IC29.B1(VOUT2) L26.1
POWER_GOOD: IC23.7(PG) IC24.7(PG) IC29.B4(PGOOD2) IC29.D4(PGOOD1) ; port POWER_GOOD
NetC209_2: C209.2 IC21.1(VOUT) IC21.2(VOUT) IC21.3(SENSE) L4.1
NetC210_2: C210.2 IC23.1(VOUT) IC23.2(SENSE) L1.1
NetC213_2: C213.2 IC24.1(VOUT) L2.1 R87.2
NetC233_2: C233.2 IC29.A3(TRACK/SS2) IC29.E3(TRACK/SS1)
NetC239_2: C239.2 IC31.3(OUT) IC31.4(SENSE) L22.1
NetC242_1: C242.1 IC30.1(SW) L20.3
NetC242_2: C242.2 D10.2(A) L20.4
NetC245_1: C245.1 IC30.3(NFB) R106.1 R107.2
NetC247_2: C247.2 IC22.4(SS)
NetC249_2: C249.2 IC23.4(SS)
NetIC24_2: IC24.2(ADJ) R87.1 R88.2
NetIC29_A4: IC29.A4(FB2) R108.1
NetIC29_A5: IC29.A5(COMP2) TP7.1
NetIC29_C3: IC29.C3(INTVCC) TP5.1
NetIC29_C4: IC29.C4(FREQ) R97.2
NetIC29_E4: IC29.E4(FB1) R110.1
NetIC29_E5: IC29.E5(COMP1) TP6.1
NetR108_2: R108.2 R109.1

Not connected (* = marked no-connect by the designer): IC21 6(NC); IC24 4(NC); IC31 6(~{SHDN})*

### Notes on the sheet
- Title
- Size:
- Date:
- A3
- Number:
- Revision:
- Sheet
- of
- Drawn by:
- File:
- (in symbol CTE3528-21_22UF_10V_10%_LESR0700) +
- (in symbol R0402_200K_1%_0.0625W_100PPM) 1%
- (in symbol R0603_1K78_0.1%_0.063W_10PPM) 0.1%
- (in symbol R0603_5K62_0.1%_0.063W_10PPM) 0.1%
- (in symbol R0603_10K2_0.1%_0.063W_10PPM) 0.1%
- (in symbol R0603_10K_1%_0.1W_100PPM) 1%
- (in symbol R0603_11K8_0.1%_0.063W_10PPM) 0.1%
- (in symbol R0603_31K6_0.1%_0.063W_10PPM) 0.1%
- (in symbol R0603_52K3_0.1%_0.063W_10PPM) 0.1%

### Library data of the parts
C208-C214 C238 C248 = CC0603_4.7UF_16V_10%_X5R: Non-polarised capacitor; Part Description: SMD Multilayer Chip Ceramic Capacitor; Manufacturer: GENERIC; Manufacturer1 Part Number: EMK107ABJ475KA-T; Voltage: 16V; TC: X5R; Tolerance: ±10%; Part Number: CC0603_4.7UF_16V_10%_X5R; Component Kind: Standard; Component Type: Standard; Pin Count: 2; Value: 4.7uF; Status: None; Manufacturer Part Number: CC0603_4.7UF_16V_10%_X5R; Case: 0603; Mounted: Yes; Socket: No; SMD: Yes; Sense: No; Manufacturer1 Example: TAIYO YUDEN; Manufacturer1 ComponentHeight: 0.95mm; HelpURL: \\cern.ch\dfs\Applications\Altium\Datasheets\CC0603_X7R_TAIYO-YUDEN_HIGH-VALUE.pdf; Author: CERN DEM JLC; CreateDate: 16.12.2013; LatestRevisionDate: 16.09.2014
C215 C232 C240 = CC0603_22UF_6.3V_20%_X5R: Non-polarised capacitor; Part Description: SMD Multilayer Chip Ceramic Capacitor; Manufacturer: GENERIC; Manufacturer1 Part Number: C1608X5R0J226M080AC; Voltage: 6.3V; TC: X5R; Tolerance: ±20%; Part Number: CC0603_22UF_6.3V_20%_X5R; Component Kind: Standard; Component Type: Standard; Pin Count: 2; Value: 22uF; Status: None; Manufacturer Part Number: CC0603_22UF_6.3V_20%_X5R; Case: 0603; Mounted: Yes; Socket: No; SMD: Yes; Sense: No; Manufacturer1 Example: TDK; Manufacturer1 ComponentHeight: 1mm; HelpURL: \\cern.ch\dfs\Applications\Altium\Datasheets\CC0603_X5R_TDK_C.pdf; Author: CERN DEM JLC; CreateDate: 16.12.2013; LatestRevisionDate: 13.09.2016
C233 = CC0402_100NF_16V_10%_X5R: Non-polarised capacitor; Part Description: SMD Multilayer Chip Ceramic Capacitor; Manufacturer: GENERIC; Manufacturer1 Part Number: GRM155R61C104KA88D; Voltage: 16V; TC: X5R; Tolerance: ±10%; Part Number: CC0402_100NF_16V_10%_X5R; Component Kind: Standard; Component Type: Standard; Pin Count: 2; Value: 100nF; Status: None; Manufacturer Part Number: CC0402_100NF_16V_10%_X5R; Case: 0402; Mounted: Yes; Socket: No; SMD: Yes; Sense: No; Manufacturer1 Example: MURATA; Manufacturer1 ComponentHeight: 0.55mm; HelpURL: \\cern.ch\dfs\Applications\Altium\Datasheets\CC0402_X5R_MURATA_GRM.pdf; Author: CERN DEM JLC; CreateDate: 10.12.2013; LatestRevisionDate: 10.12.2013
C234 C235 = CC0805_22UF_16V_10%_X5R: Non-polarised capacitor; Part Description: SMD Multilayer Chip Ceramic Capacitor; Manufacturer: GENERIC; Manufacturer1 Part Number: C2012X5R1C226KT; Voltage: 16V; TC: X5R; Tolerance: ±10%; Part Number: CC0805_22UF_16V_10%_X5R; Component Kind: Standard; Component Type: Standard; Pin Count: 2; Value: 22uF; Status: Preferred; Manufacturer Part Number: CC0805_22UF_16V_10%_X5R; Case: 0805; Mounted: Yes; Socket: No; SMD: Yes; Sense: No; Manufacturer1 Example: TDK; Manufacturer1 ComponentHeight: 1.35mm; HelpURL: \\cern.ch\dfs\Applications\Altium\Datasheets\CC0805_X5R_TDK_C.pdf; Author: CERN DEM JLC; CreateDate: 25.10.2012; LatestRevisionDate: 25.10.2012
C236 C250 C251 C253 = CC1210_47UF_10V_20%_X5R: Non-polarised capacitor; Part Description: SMD Multilayer Chip Ceramic Capacitor; Manufacturer: GENERIC; Manufacturer1 Part Number: LMK325BJ476MM-T; Voltage: 10V; TC: X5R; Tolerance: ±20%; Part Number: CC1210_47UF_10V_20%_X5R; Component Kind: Standard; Component Type: Standard; Pin Count: 2; Value: 47uF; Status: None; Manufacturer Part Number: CC1210_47UF_10V_20%_X5R; Case: 1210; Mounted: Yes; Socket: No; SMD: Yes; Sense: No; Manufacturer1 Example: TAIYO YUDEN; Manufacturer1 ComponentHeight: 2.7mm; HelpURL: \\cern.ch\dfs\Applications\Altium\Datasheets\CC1210_X5R_TAIYO-YUDEN_HIGH-VALUE.pdf; Author: CERN DEM JLC; CreateDate: 04.05.2011; LatestRevisionDate: 04.05.2011
C239 = CC0603_1UF_16V_10%_X7R: Non-polarised capacitor; Part Description: SMD Multilayer Chip Ceramic Capacitor; Manufacturer: GENERIC; Manufacturer1 Part Number: 223878615663; Voltage: 16V; TC: X7R; Tolerance: ±10%; Part Number: CC0603_1UF_16V_10%_X7R; Component Kind: Standard; Component Type: Standard; Pin Count: 2; Value: 1uF; Status: None; Manufacturer Part Number: CC0603_1uF_16V_10%_X7R; Case: 0603; Mounted: Yes; Socket: No; SMD: Yes; Sense: No; Manufacturer1 Example: YAGEO PHYCOMP; Manufacturer1 ComponentHeight: 0.9mm; HelpURL: \\cern.ch\dfs\Applications\Altium\Datasheets\CC0603_X7R_PHYCOMP.pdf; Author: CERN DEM JLC; CreateDate: 03.12.2007; LatestRevisionDate: 17.04.2015
C241 C243 C244 = CC0805_10UF_16V_10%_X5R: Non-polarised capacitor; Part Description: SMD Multilayer Chip Ceramic Capacitor; Manufacturer: GENERIC; Manufacturer1 Part Number: C0805C106K4PAC; Voltage: 16V; TC: X5R; Tolerance: ±10%; Part Number: CC0805_10UF_16V_10%_X5R; Component Kind: Standard; Component Type: Standard; Pin Count: 2; Value: 10uF; Status: Preferred; Manufacturer Part Number: CC0805_10UF_16V_10%_X5R; Case: 0805; Mounted: Yes; Socket: No; SMD: Yes; Sense: No; Manufacturer1 Example: KEMET; Manufacturer1 ComponentHeight: 1.4mm; HelpURL: \\cern.ch\dfs\Applications\Altium\Datasheets\CC1206_X5R_KEMET.pdf; Author: CERN DEM JLC; CreateDate: 03.12.2007; LatestRevisionDate: 03.12.2007
C242 = CC0603_1UF_25V_10%_X7R: Non-polarised capacitor; Part Description: SMD Multilayer Chip Ceramic Capacitor; Manufacturer: GENERIC; Manufacturer1 Part Number: GRM188R71E105KA12D; Voltage: 25V; TC: X7R; Tolerance: ±10%; Part Number: CC0603_1UF_25V_10%_X7R; Component Kind: Standard; Component Type: Standard; Pin Count: 2; Value: 1uF; Status: None; Manufacturer Part Number: CC0603_1UF_25V_10%_X7R; Case: 0603; Mounted: Yes; Socket: No; SMD: Yes; Sense: No; Manufacturer1 Example: MURATA; Manufacturer1 ComponentHeight: 0.9mm; HelpURL: \\cern.ch\dfs\Applications\Altium\Datasheets\CC0603_X7R_MURATA.pdf; Author: CERN DEM JLC; CreateDate: 18.01.2011; LatestRevisionDate: 18.01.2011
C245 = CC0402_150PF_50V_5%_C0G: Non-polarised capacitor; Part Description: SMD Multilayer Chip Ceramic Capacitor; Manufacturer: GENERIC; Manufacturer1 Part Number: C0402C151J5GACTU; Voltage: 50V; TC: C0G/NP0; Tolerance: ±5%; Part Number: CC0402_150PF_50V_5%_C0G; Component Kind: Standard; Component Type: Standard; Pin Count: 2; Value: 150pF; Status: Preferred; Manufacturer Part Number: CC0402_150PF_50V_5%_C0G; Case: 0402; Mounted: Yes; Socket: No; SMD: Yes; Sense: No; Manufacturer1 Example: KEMET; Manufacturer1 ComponentHeight: 0.55mm; HelpURL: \\cern.ch\dfs\Applications\Altium\Datasheets\CC0805_C0G_KEMET_(Commercial Grade).pdf; Author: CERN DEM JLC; CreateDate: 03.12.2007; LatestRevisionDate: 22.04.2015
C247 C249 = CC0201_1NF_16V_10%_X5R: Non-polarised capacitor; Part Description: SMD Multilayer Chip Ceramic Capacitor; Manufacturer: GENERIC; Manufacturer1 Part Number: 0201YD102KAT2A; Voltage: 16V; TC: X5R; Tolerance: ±10%; Part Number: CC0201_1NF_16V_10%_X5R; Component Kind: Standard; Component Type: Standard; Pin Count: 2; Value: 1nF; Status: Not Recommended; Manufacturer Part Number: CC0201_1NF_16V_10%_X5R; Case: 0201; Mounted: Yes; Socket: No; SMD: Yes; Sense: No; Manufacturer1 Example: AVX; Manufacturer1 ComponentHeight: 0.33mm; HelpURL: \\cern.ch\dfs\Applications\Altium\Datasheets\CC0201_X5R_AVX.pdf; Author: CERN DEM JLC; CreateDate: 03.12.2007; LatestRevisionDate: 03.12.2007
C252 C254 = CTE3528-21_22UF_10V_10%_LESR0700: Polarised capacitor; Part Description: Low ESR 0R7 Solid Tantalum Chip Capacitor; Manufacturer: GENERIC; Manufacturer1 Part Number: TPSB226K010R0700; Voltage: 10V; Tolerance: ±10%; Part Number: CTE3528-21_22UF_10V_10%_LESR0700; Component Kind: Standard; Component Type: Standard; Pin Count: 2; Value: 22uF; Status: Preferred; Manufacturer Part Number: CTE3528-21_22UF_10V_10%_LESR0700; Case: B; Mounted: Yes; Socket: No; SMD: Yes; Sense: No; Manufacturer1 Example: AVX; Manufacturer1 ComponentHeight: 2.1mm; HelpURL: \\cern.ch\dfs\Applications\Altium\Datasheets\CTE-LESR_AVX_TPS.pdf; Author: CERN DEM JLC; CreateDate: 05.05.2008; LatestRevisionDate: 20.01.2009
D10 = MBR0530T1G: Schottky Diode; Part Description: Schottky Power Rectifier; Manufacturer: ON SEMICONDUCTOR; Voltage: 30V; Power: 500mA; PressFit: No; Bonding: No; Part Number: MBR0530T1G; Component Kind: Standard; Component Type: Standard; Device: MBR0530T1G; PackageDescription: SOD Diode (SOD-123); 2.70mm W X 1.55mm L X 1.45mm H body, IPC Medium Density; Manufacturer Part Number: MBR0530T1G; Pin Count: 2; Case: SOD-123; Mounted: Yes; Socket: No; SMD: Yes; Sense: No; ComponentHeight: 1.45mm; HelpURL: \\cern.ch\dfs\Applications\Altium\Datasheets\MBR0530T1G.pdf; Author: CERN DEM JLC; CreateDate: 21.07.2010; LatestRevisionDate: 21.07.2010
IC21 = ADP124ACPZ-3.3-R7: 500 mA, Low Quiescent Current, CMOS Linear Regulator, 2.3 to 5.5 V Vin, 3.3 V Vout, Industrial, 8-pin SON (CP-8-8), Reel; Manufacturer: Analog Devices; Iout max: 500mA; Preset Vout Values (V): 3.3; Supply Current IGND @ Small Load: 45uA; Vin (min) (V): 2.3; Vin (max) (V): 5.5; Mounting Technology: Surface Mount; ComponentLink3URL: http:/www.analog.com/static/imported-files/packages/PKG_PDF/LFCSP(CP)/CP_8_8.pdf; ComponentLink1Description: Manufacturer URL; ComponentLink2Description: Datasheet; ComponentLink4URL: Product URL:http://www.analog.com/en/ADP124/productSearch.html; ComponentLink1URL: http://www.analog.com/en/index.html; PackageReference: CP-8-8; ComponentLink2URL: http://www.analog.com/static/imported-files/data_sheets/ADP124_125.pdf; ComponentLink4Description: URL Link1; PackageDescription: 8-Pin Lead Frame Chip Scale Package, Body 2 x 2 mm, Pitch 0.5 mm; ComponentLink3Description: Package Specification; Manufacturer Part Number: ADP124ACPZ-3.3-R7
IC22 = ADM7171ACPZ-3.3-R7: 6.5 V, 1 A, Ultralow Noise, High PSRR,  Fast Transient Response CMOS LDO; Manufacturer: Analog Devices; Value: Value; Type: Type; Manufacturer Part Number: ADM7171ACPZ-3.3-R7
IC23 = ADP7105ACPZ-5.0-R7: 20 V, 500 mA, Low Noise LDO Regulator  with Soft Start; Manufacturer: Analog Devices; Value: Value; Type: Type; Manufacturer Part Number: ADP7105ACPZ-5.0-R7
IC24 = ADP7104ACPZ-R7: 20 V, 500 mA, Low Noise CMOS LDO; Manufacturer: Analog Devices; Value: Value; Type: Type; Manufacturer Part Number: ADP7104ACPZ-R7
IC29 = LTM4622IV#PBF: Dual Ultrathin 2A or Single 4A, 3.6V to 20V, 1.5V to 12V   Step-Down DC/DC µModule Regulator; Manufacturer: LINEAR TECHNOLOGY; Manufacturer Part Number: LTM4622AEV#PBF
IC30 = LT1931ES5#TRMPBF: 1.2MHz/2.2MHz Inverting DC/DC Converters in ThinSOT; Part Description: +16V to (-0.4V to -36V), 1.2MHz Inverting DC-DC Converters; Manufacturer: LINEAR TECHNOLOGY; PressFit: No; Bonding: No; Part Number: LT1931ES5#TRMPBF; Component Kind: Standard; Component Type: Standard; Device: LT1931ES5#TRMPBF; PackageDescription: SOT23, 0.95mm pitch; 5 pin, 1.6mm W X 2.9mm L, IPC Medium Density; Manufacturer Part Number: LT1931ES5#TRMPBF; Pin Count: 5; Case: SOT23; Mounted: Yes; Socket: No; SMD: Yes; Sense: No; ComponentHeight: 1mm; HelpURL: \\cern.ch\dfs\Applications\Altium\Datasheets\LT1931ES5#TRMPBF.pdf; Author: CERN DEM JLC; CreateDate: 18.01.2010; LatestRevisionDate: 18.04.2012
IC31 = LT1175CS8#PBF: 5V 500mA Negative Low Dropout Micropower Regulator; Manufacturer: LINEAR TECHNOLOGY; Table: Regulators; Part Number: LT1175CS8#PBF; Component Kind: Standard; Component Type: Standard; Device: LT1175CS8-5#PBF; PackageDescription: SOIC 8, Pitch 1.27mm - Body 4x5mm, IPC Medium Density; Part Description: 5V 500mA Negative Low Dropout Micropower Regulator; Manufacturer Part Number: LT1175CS8-5#PBF; Pin Count: 8; Case: SOIC8; Mounted: Yes; Socket: No; SMD: Yes; ComponentHeight: 1.75mm; HelpURL: \\cern.ch\dfs\Applications\Altium\Datasheets\LT1175CS8#PBF.pdf; Author: CERN DEM JLC; CreateDate: 18.01.2010; LatestRevisionDate: 18.01.2010
L1 L2 L4 L18 L22-L24 = IND0603_MURATA_BLM18SG121TN1D: as L3 on sheet CLOCK; Part Number: IND0603_MURATA_BLM18SG121TN1D; Component Kind: Standard; Component Type: Standard; Pin Count: 2; Value: 120R@100MHz; Status: None; Manufacturer Part Number: BLM18SG121TN1D; Case: 0603; Mounted: Yes; Socket: No; SMD: Yes; Sense: No; ComponentHeight: 0.65mm; HelpURL: \\cern.ch\dfs\Applications\Altium\Datasheets\IND0603_MURATA_BLM18S.pdf; Author: CERN DEM JLC; CreateDate: 23.07.2014; LatestRevisionDate: 23.07.2014
L20 = IND_10UH_20%_BOURNS_SRF0703: Dual-Winding Shielded Power Inductor SRF0703 Serie; Manufacturer: BOURNS; Manufacturer Part Number: SRF0703-100M; Power: 2.08A; Resistance: 0.0826R; Tolerance: ±20%; Part Number: IND_10UH_20%_BOURNS_SRF0703; Component Kind: Standard; Component Type: Standard; Pin Count: 2; Value: 10uH; Status: None; Part Description: Dual-Winding Shielded Power Inductor; Mounted: Yes; Socket: No; SMD: Yes; Sense: No; ComponentHeight: 3.6mm; HelpURL: \\cern.ch\dfs\Applications\Altium\Datasheets\IND_BOURNS_SRF0703.pdf; Author: CERN DEM JLC; CreateDate: 26.03.2013; LatestRevisionDate: 26.03.2013
L25 L26 = IND_1.5UH_20%_TDK_SPM4020-LR: Inductor With Core; Part Description: SMD Inductor for Power Circuits (Wound Metal), SPM Series; Manufacturer: TDK; Manufacturer Part Number: SPM4020T-1R5M-LR; Power: 6.3A; Resistance: 0.0399R; Tolerance: ±20%; Part Number: IND_1.5UH_20%_TDK_SPM4020-LR; Component Kind: Standard; Component Type: Standard; Footprint: IND_TDK_SPM4020-LR; Pin Count: 2; Value: 1.5uH; Status: None; Mounted: Yes; Socket: No; SMD: Yes; Sense: No; ComponentHeight: 3mm; HelpURL: \\cern.ch\dfs\Applications\Altium\Datasheets\IND_TDK_SPM6530.pdf; Author: CERN DEM MR; CreateDate: 08.11.2016; LatestRevisionDate: 08.11.2016
R87 = R0603_31K6_0.1%_0.063W_10PPM: Resistor - 0.1%; Part Description: Thin Film Chip Resistor; Manufacturer: GENERIC; Manufacturer1 Part Number: RN73C1J31K6BTDF; Power: 0.063W; TC: ±10ppm; Part Number: R0603_31K6_0.1%_0.063W_10PPM; Component Kind: Standard; Component Type: Standard; Pin Count: 2; Value: 31k6; Status: Not recommended; Tolerance: ±0.1%; Manufacturer Part Number: R0603_31K6_0.1%_0.063W_10PPM; Case: 0603; Mounted: Yes; Sense: No; Socket: No; SMD: Yes; Manufacturer1 Example: TYCO HOLSWORTHY; Manufacturer1 ComponentHeight: 0.5mm; HelpURL: \\cern.ch\dfs\Applications\Altium\Datasheets\R0603_Tyco_RN73.pdf; Author: CERN DEM JLC; CreateDate: 03.12.2007; LatestRevisionDate: 13.03.2008
R88 = R0603_10K2_0.1%_0.063W_10PPM: Resistor - 0.1%; Part Description: Thin Film Chip Resistor; Manufacturer: GENERIC; Manufacturer1 Part Number: RN73C1J10K2BTDF; Power: 0.063W; TC: ±10ppm; Part Number: R0603_10K2_0.1%_0.063W_10PPM; Component Kind: Standard; Component Type: Standard; Pin Count: 2; Value: 10k2; Status: Not recommended; Tolerance: ±0.1%; Manufacturer Part Number: R0603_10K2_0.1%_0.063W_10PPM; Case: 0603; Mounted: Yes; Sense: No; Socket: No; SMD: Yes; Manufacturer1 Example: TYCO HOLSWORTHY; Manufacturer1 ComponentHeight: 0.5mm; HelpURL: \\cern.ch\dfs\Applications\Altium\Datasheets\R0603_Tyco_RN73.pdf; Author: CERN DEM JLC; CreateDate: 03.12.2007; LatestRevisionDate: 13.03.2008
R97 = R0402_200K_1%_0.0625W_100PPM: Resistor - 1%; Part Description: General Purpose Thick Film Chip Resistor; Manufacturer: GENERIC; Manufacturer1 Part Number: 232270672004L; TC: ±100ppm/°C; Part Number: R0402_200K_1%_0.0625W_100PPM; Component Kind: Standard; Component Type: Standard; Pin Count: 2; Value: 200k; Status: Not recommended; Power: 0.0625W; Tolerance: ±1%; Manufacturer Part Number: R0402_200K_1%_0.0625W_100PPM; Case: 0402; Mounted: Yes; Sense: No; Socket: No; SMD: Yes; Manufacturer1 Example: YAGEO PHYCOMP; Manufacturer1 ComponentHeight: 0.4mm; HelpURL: \\cern.ch\dfs\Applications\Altium\Datasheets\R0402_Phycomp_RC0402.pdf; Author: CERN DEM JLC; CreateDate: 03.12.2007; LatestRevisionDate: 17.10.2012
R106 = R0603_52K3_0.1%_0.063W_10PPM: Resistor - 0.1%; Part Description: Thin Film Chip Resistor; Manufacturer: GENERIC; Manufacturer1 Part Number: RN73C1J52K3BTDF; Power: 0.063W; TC: ±10ppm; Part Number: R0603_52K3_0.1%_0.063W_10PPM; Component Kind: Standard; Component Type: Standard; Pin Count: 2; Value: 52k3; Status: Not recommended; Tolerance: ±0.1%; Manufacturer Part Number: R0603_52K3_0.1%_0.063W_10PPM; Case: 0603; Mounted: Yes; Sense: No; Socket: No; SMD: Yes; Manufacturer1 Example: TYCO HOLSWORTHY; Manufacturer1 ComponentHeight: 0.5mm; HelpURL: \\cern.ch\dfs\Applications\Altium\Datasheets\R0603_Tyco_RN73.pdf; Author: CERN DEM JLC; CreateDate: 03.12.2007; LatestRevisionDate: 13.03.2008
R107 = R0603_10K_1%_0.1W_100PPM: Resistor - 1%; Part Description: General Purpose Thick Film Chip Resistor; Manufacturer: GENERIC; Manufacturer1 Part Number: NRC06F1002TRF; Power: 0.1W; TC: ±100ppm/°C; Part Number: R0603_10K_1%_0.1W_100PPM; Component Kind: Standard; Component Type: Standard; Pin Count: 2; Value: 10k; Status: Preferred; Tolerance: ±1%; Manufacturer Part Number: R0603_10K_1%_0.1W_100PPM; Case: 0603; Mounted: Yes; Sense: No; Socket: No; SMD: Yes; Manufacturer1 Example: NIC COMPONENT; Manufacturer1 ComponentHeight: 0.55mm; HelpURL: \\cern.ch\dfs\Applications\Altium\Datasheets\R0603_NIC_NRC.pdf; Author: CERN DEM JLC; CreateDate: 03.12.2007; LatestRevisionDate: 13.03.2008
R108 = R0603_5K62_0.1%_0.063W_10PPM: Resistor - 0.1%; Part Description: Thin Film Chip Resistor; Manufacturer: GENERIC; Manufacturer1 Part Number: RN73C1J5K62BTDF; Power: 0.063W; TC: ±10ppm; Part Number: R0603_5K62_0.1%_0.063W_10PPM; Component Kind: Standard; Component Type: Standard; Pin Count: 2; Value: 5k62; Status: Not recommended; Tolerance: ±0.1%; Manufacturer Part Number: R0603_5K62_0.1%_0.063W_10PPM; Case: 0603; Mounted: Yes; Sense: No; Socket: No; SMD: Yes; Manufacturer1 Example: TYCO HOLSWORTHY; Manufacturer1 ComponentHeight: 0.5mm; HelpURL: \\cern.ch\dfs\Applications\Altium\Datasheets\R0603_Tyco_RN73.pdf; Author: CERN DEM JLC; CreateDate: 03.12.2007; LatestRevisionDate: 13.03.2008
R109 = R0603_1K78_0.1%_0.063W_10PPM: Resistor - 0.1%; Part Description: Thin Film Chip Resistor; Manufacturer: GENERIC; Manufacturer1 Part Number: RN73C1J1K78BTDF; Power: 0.063W; TC: ±10ppm; Part Number: R0603_1K78_0.1%_0.063W_10PPM; Component Kind: Standard; Component Type: Standard; Pin Count: 2; Value: 1k78; Status: Not recommended; Tolerance: ±0.1%; Manufacturer Part Number: R0603_1K78_0.1%_0.063W_10PPM; Case: 0603; Mounted: Yes; Sense: No; Socket: No; SMD: Yes; Manufacturer1 Example: TYCO HOLSWORTHY; Manufacturer1 ComponentHeight: 0.5mm; HelpURL: \\cern.ch\dfs\Applications\Altium\Datasheets\R0603_Tyco_RN73.pdf; Author: CERN DEM JLC; CreateDate: 03.12.2007; LatestRevisionDate: 13.03.2008
R110 = R0603_11K8_0.1%_0.063W_10PPM: Resistor - 0.1%; Part Description: Thin Film Chip Resistor; Manufacturer: GENERIC; Manufacturer1 Part Number: RN73C1J11K8BTDF; Power: 0.063W; TC: ±10ppm; Part Number: R0603_11K8_0.1%_0.063W_10PPM; Component Kind: Standard; Component Type: Standard; Pin Count: 2; Value: 11k8; Status: Not recommended; Tolerance: ±0.1%; Manufacturer Part Number: R0603_11K8_0.1%_0.063W_10PPM; Case: 0603; Mounted: Yes; Sense: No; Socket: No; SMD: Yes; Manufacturer1 Example: TYCO HOLSWORTHY; Manufacturer1 ComponentHeight: 0.5mm; HelpURL: \\cern.ch\dfs\Applications\Altium\Datasheets\R0603_Tyco_RN73.pdf; Author: CERN DEM JLC; CreateDate: 03.12.2007; LatestRevisionDate: 13.03.2008
TP5-TP7 = SMD_PAD_0.62X0.62MM: Part Description: 0.62mm x 0.62mm PCB Copper Area (SMD Test Point); Mounted: No; Part Number: SMD_PAD_0.62X0.62MM; Component Kind: Standard (No BOM); Component Type: Standard (No BOM); Pin Count: 1; Family: Test Point; Socket: No; SMD: Yes; Sense: No; Status: None; ComponentHeight: 0mm; HelpURL: Undefined; Author: CERN DEM JLC; CreateDate: 12.01.2008; LatestRevisionDate: 12.01.2008; PackageDescription: 0.62mm x 0.62mm PCB Copper Area (SMD Test Point)